# Altium project Audio amplifier.PrjPcb
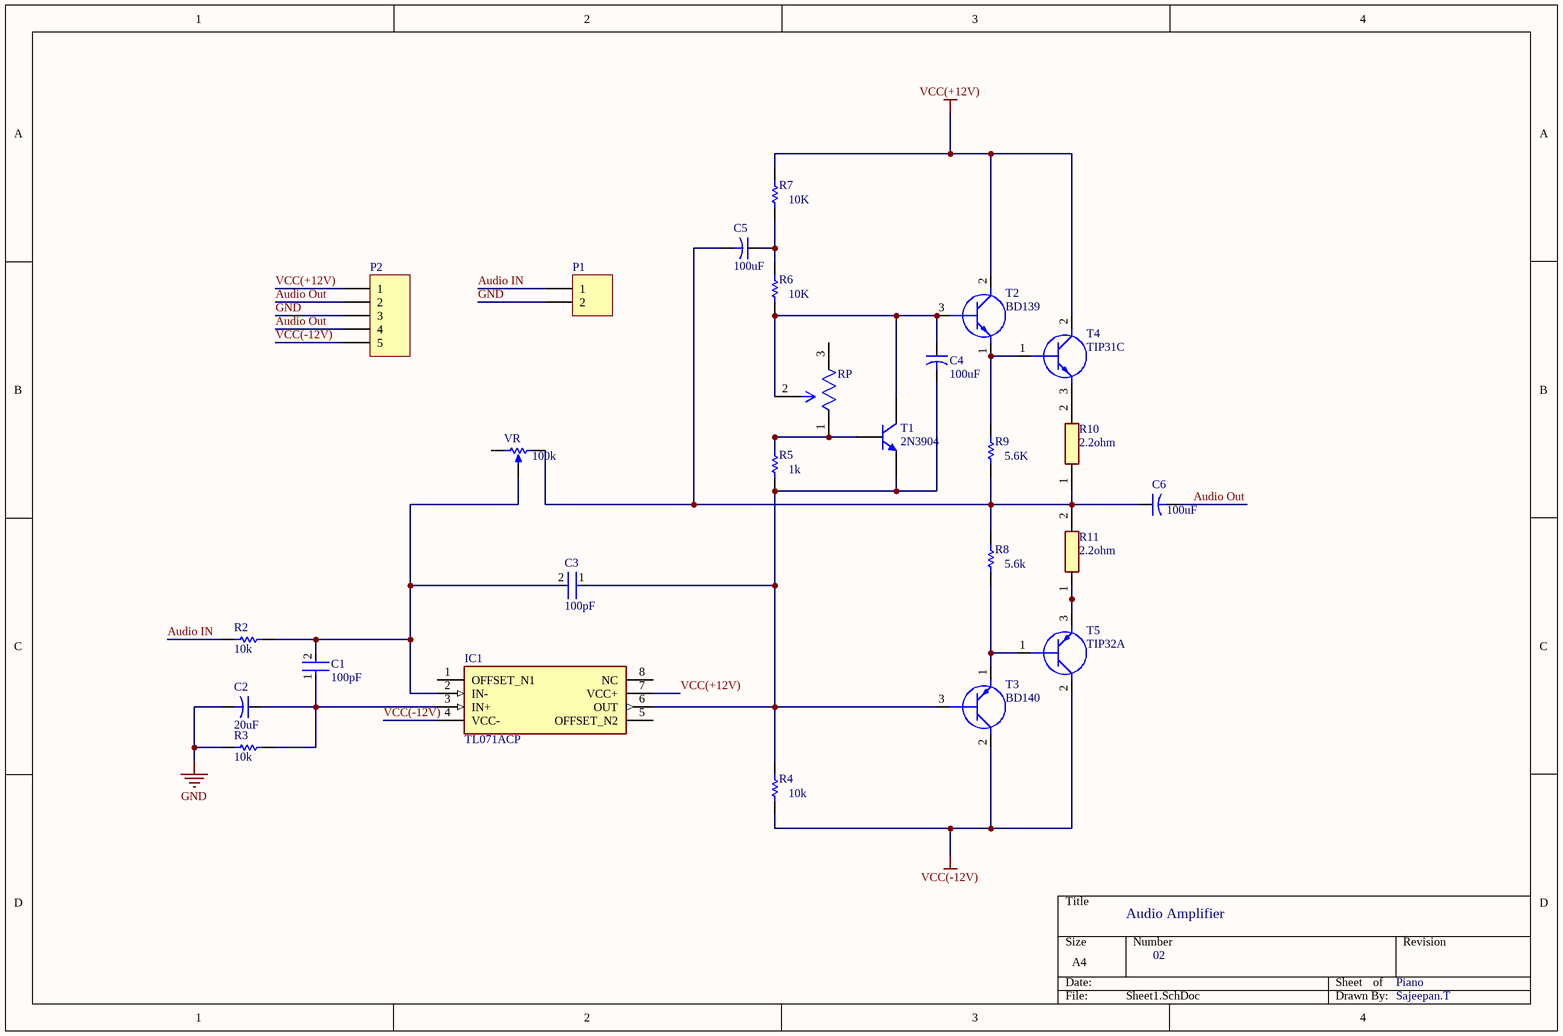
[diagram p0: Sheet1.SchDoc]
1 sheet, 26 parts. Net scope: global (net labels, ports and power ports of the same name join across sheets).
Board file: PCB1.PcbDoc

## Sheet Sheet1.SchDoc
size A4

### Parts
C1  100pF  [FP-RHS0DG-MFG]
C2  value 20uF  [CAPR5-4X5]  (hidden comment: Cap2)
C3  100pF  [FP-RHS0DG-MFG]
C4  value 100uF  [CAPR5-4X5]  (hidden comment: Cap2)
C5  value 100uF  [CAPR5-4X5]  (hidden comment: Cap2)
C6  value 100uF  [CAPR5-4X5]  (hidden comment: Cap2)
IC1  TL071ACP  [DIP794W53P254L959H508Q8N]
P1  Header 2  [HDR1X2]  (value not drawn)
P2  Header 5  [HDR1X5]  (value not drawn)
R2  value 10k  [AXIAL-0.3]  (hidden comment: Res1)
R3  value 10k  [AXIAL-0.3]  (hidden comment: Res1)
R4  value 10k  [AXIAL-0.3]  (hidden comment: Res1)
R5  value 1k  [AXIAL-0.3]  (hidden comment: Res1)
R6  value 10K  [AXIAL-0.3]  (hidden comment: Res1)
R7  value 10K  [AXIAL-0.3]  (hidden comment: Res1)
R8  value 5.6k  [AXIAL-0.3]  (hidden comment: Res1)
R9  value 5.6K  [AXIAL-0.3]  (hidden comment: Res1)
R10  2.2ohm  [RESAD1130W50L370D190]
R11  2.2ohm  [RESAD1130W50L370D190]
RP  3386F-1-303LF  [FP-3386F-MFG]  (value not drawn)
T1  2N3904  [TO-92A]
T2  BD139  [TO229P300X760X1364-3P]
T3  BD140  [TO229P345X800X1460-3P]
T4  TIP31C  [TO254P470X1016X2019-3P]
T5  TIP32A  [TO254P470X1016X2019-3P]
VR  100k  [BOUR-3852A-282-103AL-3_V]

### Nets
GND: C2.2 P1.2 P2.3 R3.2
VCC(+12V): IC1.7(VCC+) P2.1 R7.2 T2.2(C) T4.2(C)
VCC(-12V): IC1.4(VCC-) P2.5 R4.1 T3.2(C) T5.2(C)
Audio IN: P1.1 R2.2
Audio Out: C6.2 P2.2 P2.4
NetC1_1: C1.1 C2.1 IC1.3(IN+) R3.1
NetC1_2: C1.2 C3.2 IC1.2(IN-) R2.1 VR.2(S)
NetC3_1: C3.1 C4.2 IC1.6(OUT) R4.2 R5.1 T1.1(E) T3.3(B)
NetC4_1: C4.1 R6.1 RP.2(WIPER) T1.3(C) T2.3(B)
NetC5_1: C5.1 R6.2 R7.1
NetC5_2: C5.2 C6.1 R8.2 R9.1 R10.1 R11.2 VR.3(CW)
NetR5_2: R5.2 RP.1(CCW) T1.2(B)
NetR8_1: R8.1 T3.1(E) T5.1(B)
NetR9_2: R9.2 T2.1(E) T4.1(B)
NetR10_2: R10.2 T4.3(E)
NetR11_1: R11.1 T5.3(E)

Not connected (* = marked no-connect by the designer): IC1 1(OFFSET_N1) 5(OFFSET_N2) 8(NC); RP 3(CW); VR 1(CCW)

### Notes on the sheet
- Audio Amplifier
- 02
- Piano
- Sajeepan.T

### Library data of the parts
C1 C3 = CMP-06035-000016-1: CAP CER 100PF 100V CCG THRUHOLE; Manufacturer: Murata; Manufacturer Part Number: RHS7G2A101J0DGH01A; Tolerance: 5%; Automotive Grade: Grade 0; Material: Ceramic; Temperature Coefficient: 72ppm/°C; Temperature Range Low: -55°C; ComponentLink2URL: https://search.murata.co.jp/Ceramy/image/img/A01X/G101/ENG/RHS_CCG_100V_E.pdf; Lead Free: Yes; Device Class L3: Ceramic Capacitors; ComponentLink2Description: Datasheet; Height: 5mm; Category: Cap; RoHS: TRUE; Voltage Rating: 100V; Value: 100pF; Octopart: https://octopart.com/rhs7g2a101j0dgh01a-murata-91590056; Temperature Range High: +200°C; Capacitance: 100pF; Device Class L1: Passive Components; Automotive: Yes; Temperature: -55°C to +200°C; Package: RHS0DG; Device Class L2: Capacitors; Temperature Characteristic: CCG; Digikey Description: CAP CER 100PF 100V CCG THRUHOLE
C2 C4-C6 = Cap2: Capacitor; Published: 23-Sep-2002; PackageReference: CAPR5-4X5; Publisher: Altium Limited; PackageDescription: Capacitor; 2 Leads
IC1 = TL071ACP: Integrated Circuit; Manufacturer_Name: Texas Instruments; Datasheet Link: http://www.ti.com/lit/ds/symlink/tl071a.pdf; Height: 5.08mm; Manufacturer_Part_Number: TL071ACP; Mouser Part Number: 595-TL071ACP; Mouser Price/Stock: https://www.mouser.co.uk/ProductDetail/Texas-Instruments/TL071ACP?qs=FM6NhYOeeBXD6FjYObfIhg%3D%3D; Arrow Part Number: TL071ACP; Arrow Price/Stock: https://www.arrow.com/en/products/tl071acp/texas-instruments?region=nac
P1 = Header 2: Header, 2-Pin; LatestRevisionDate: 17-Jul-2002; LatestRevisionNote: Re-released for DXP Platform.; Publisher: Altium Limited
P2 = Header 5: Header, 5-Pin; LatestRevisionDate: 17-Jul-2002; LatestRevisionNote: Re-released for DXP Platform.; Publisher: Altium Limited
R2-R9 = Res1: Resistor; Published: 8-Jun-2000; LatestRevisionDate: 17-Jul-2002; LatestRevisionNote: Re-released for DXP Platform.; PackageReference: AXIAL-0.3; Publisher: Altium Limited; PackageDescription: Axial Device, Thru-Hole; 2 Leads; 0.3 in Pin Spacing
R10 R11 = MFF04FF6800A5: Resistor; Manufacturer_Name: ROYALOHM; Datasheet Link: https://www.tme.eu/Document/353a4c49cd04d4760ab7ace851501ebe/metal_film.pdf; Manufacturer_Part_Number: MFF04FF6800A5
RP = CMP-07234-000018-1: TRIMMER 30K OHM 0.5W PC PIN TOP; Manufacturer: Bourns; Voltage Rating: 300V; Tolerance: 10%; Value: 30kΩ; Standoff Height: 0.38mm; Temperature Coefficient: 100ppm/°C; Category: Res; Series: 3386; Device Class L1: Passive Components; Temperature Range Low: -55°C; RoHS: TRUE; Temperature: -55°C to +125°C; Device Class L2: Resistors; ComponentLink2URL: https://www.bourns.com/docs/Product-Datasheets/3386.pdf; Mouser Description: Trimmer Resistors - Through Hole 3/8 30Kohms 10% 0.5Watts Square; Manufacturer Part Number: 3386F-1-303LF; Octopart: https://octopart.com/3386f-1-303lf-bourns-1032328; Digikey Description: TRIMMER 30K OHM 0.5W PC PIN TOP; Lead Free: Yes; Automotive: No; Package: 3386F; Temperature Range High: +125°C; Composition: Cermet; ComponentLink2Description: Datasheet; Power Rating: 0.5W; Height: 5.08mm; Resistance: 30kΩ; Device Class L3: Variable Resistors and Potentiometers
T1 = 2N3904: NPN General Purpose Amplifier; Published: 8-Jun-2000; LatestRevisionDate: 15-Jan-2003; LatestRevisionNote: PCB Footprint 'BCY-W3/D4.7' replaced; DatasheetVersion: 1997; PackageVersion: Sep-1998; PackageReference: TO-92A; Publisher: Altium Limited; PackageDescription: TO, Flat Index; 3 In-Line, Axial Leads; Body Dia. 4.5mm; Leads 0.51 x 0.48 mm (max); ComponentLink1Description: Manufacturer Link; ComponentLink1URL: http://www.fairchildsemi.com/; ComponentLink2Description: Datasheet; ComponentLink2URL: http://www.fairchildsemi.com/ds/2N%2F2N3904.pdf
T2 = BD139: Transistor BJT NPN; Manufacturer_Name: ON Semiconductor; Datasheet Link: http://www.onsemi.com/pub/Collateral/BD135-D.PDF; Height: 3mm; Manufacturer_Part_Number: BD139; Mouser Part Number: 863-BD139; Mouser Price/Stock: https://www.mouser.co.uk/ProductDetail/onsemi/BD139?qs=vNc2DXHODiI0%252BZZC8g2wVg%3D%3D
T3 = BD14010STU: Transistor BJT PNP; Manufacturer_Name: ON Semiconductor; Datasheet Link: http://www.mouser.com/ds/2/149/BD140-888626.pdf; Height: 3.45mm; Manufacturer_Part_Number: BD14010STU; Mouser Part Number: 512-BD14010STU; Mouser Price/Stock: https://www.mouser.co.uk/ProductDetail/ON-Semiconductor-Fairchild/BD14010STU?qs=ljbEvF4DwOOnoRfj89Fh0g%3D%3D; Arrow Part Number: BD14010STU; Arrow Price/Stock: https://www.arrow.com/en/products/bd14010stu/on-semiconductor?region=nac
T4 = TIP31C: Transistor BJT NPN; Manufacturer_Name: Bourns; Datasheet Link: https://www.mouser.com/datasheet/2/149/fairchild%20semiconductor_tip31a-549394.pdf; Height: 4.7mm; Manufacturer_Part_Number: TIP31C
T5 = TIP32A: Transistor BJT PNP; Manufacturer_Name: ON Semiconductor; Datasheet Link: https://www.jameco.com/Jameco/Products/ProdDS/33064.pdf; Height: 4.7mm; Manufacturer_Part_Number: TIP32A; Mouser Part Number: 512-TIP32A; Mouser Price/Stock: https://www.mouser.co.uk/ProductDetail/ON-Semiconductor-Fairchild/TIP32A?qs=P36CEcFBmYytOK49o0vnfw%3D%3D; Arrow Part Number: TIP32A; Arrow Price/Stock: https://www.arrow.com/en/products/tip32a/on-semiconductor
VR = CMP-2000-05079-1: Diameter Panel Control, 10 KOhm, +/- 10%, 2 W, -1 to 125 degC, 3-Pin THD, RoHS, Bulk; Manufacturer: Bourns; Temperature Coefficient: ±150ppm/degC; Number of Gangs: 1; Other Names: 3852A282103AL; Actuator Length: 0.875"(22.23mm); Resistive Material: Cermet; PCN Design/Specification: PBTResinJun/2011; Rotation: 280deg; PCN Other: MultipleChanges01/Dec/2012; Catalog Drawings: 3852SeriesSide1 / 3852SeriesSide2; Online Catalog: 3852and3856Series; Associated Product: 36-8560-ND / -KNOBINSTRUMW/DIALRND.9"DIA / 36-8555-ND / -KNOBINSTRUMSKIRTEDRND.7"DIA / 36-8556-ND / -KNOBINSTRUMSKIRTEDRND.9"DIA / 36-8565-ND / -KNOBINSTRUMDBLBARRND.7"DIA / 36-8566-ND / -KNOBINSTRUMDBLBARRND.9"DIA / 36-8568-ND / -KNOBINSTRUMSGLBARRND.7"DIA / 36-8569-ND / -KNOBINSTRUMSGLBARRND.9"DIA / 36-8559-ND / -KNOBINSTRUMW/DIALRND.7"DIA / 226-1006-ND / -KNOBBLKGLOSS.75"DIA.250"SHAFT / 226-1007-ND / -KNOBBLKGLOSS.925"DIA.250"SHAFT / 226-1011-ND / -KNOBBLKGLOS; Actuator Diameter: 0.250"(6.35mm); Built in Switch: None; Resistance (Ohms): 10k; Power (Watts): 2W; Actuator Type: Slotted; Standard Package: 45; Tolerance: ±10%; Taper: Linear; Series: 3852; Packaging: Bulk; Category: Potentiometers,VariableResistors; Bushing Thread: 3/8-32; Datasheet URL: https://datasheet.ciiva.com/11831/0900766b80f93b4b-11831016.pdf; Datasheet Version: Sep-14; Number of Turns: 1; Family: RotaryPotentiometers,Rheostats; Termination Style: SolderLug; RoHS Information: 3852A-LMaterialDeclaration; Mounting Type: PanelMount; Manufacturer URL: http://www.bourns.com/